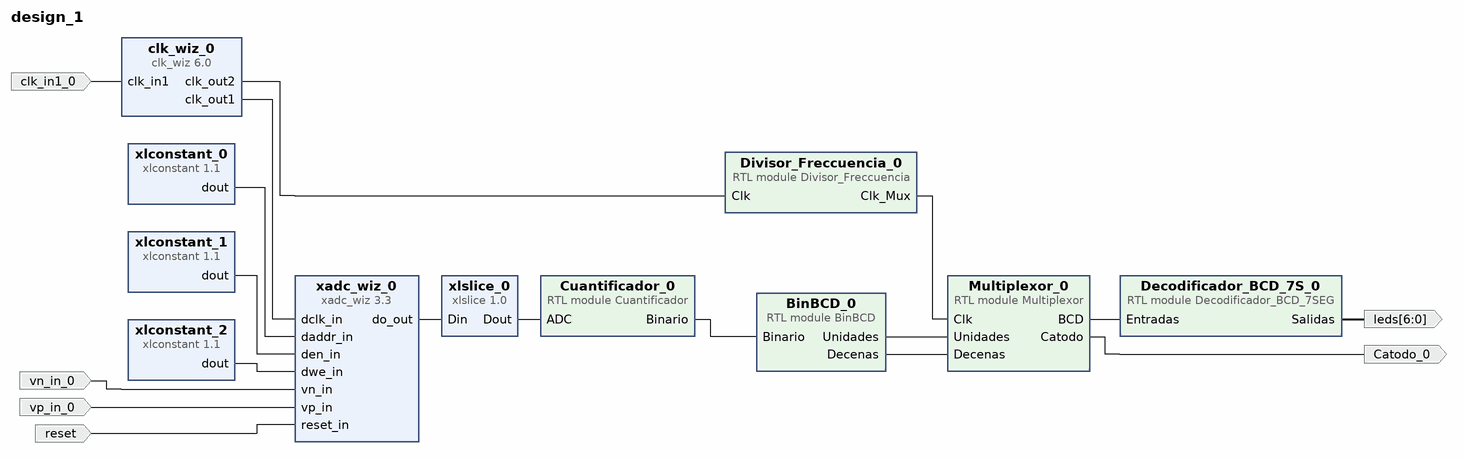
[diagram p0: block diagram of the top level]
# Vivado block design design_1, xc7z007sclg400-1, Vivado 2019.1
create_bd_design design_1

create_bd_port -dir I vn_in_0
create_bd_port -dir I vp_in_0
create_bd_port -dir I reset
create_bd_port -dir O -from 6 -to 0 leds
create_bd_port -dir I -type clk clk_in1_0
set_property -dict {CONFIG.FREQ_HZ 125000000} [get_bd_ports clk_in1_0]
create_bd_port -dir O Catodo_0

create_bd_cell -type ip -vlnv xilinx.com:ip:xadc_wiz:3.3 xadc_wiz_0
set_property -dict [list \
  CONFIG.ACQUISITION_TIME 10 \
  CONFIG.ADC_CONVERSION_RATE 39 \
  CONFIG.CHANNEL_AVERAGING 256 \
  CONFIG.DCLK_FREQUENCY 8 \
  CONFIG.ENABLE_RESET true \
  CONFIG.ENABLE_VCCDDRO_ALARM false \
  CONFIG.ENABLE_VCCPAUX_ALARM false \
  CONFIG.ENABLE_VCCPINT_ALARM false \
  CONFIG.EXTERNAL_MUX_CHANNEL VP_VN \
  CONFIG.INTERFACE_SELECTION ENABLE_DRP \
  CONFIG.OT_ALARM false \
  CONFIG.SINGLE_CHANNEL_ACQUISITION_TIME true \
  CONFIG.SINGLE_CHANNEL_SELECTION VP_VN \
  CONFIG.USER_TEMP_ALARM false \
  CONFIG.VCCAUX_ALARM false \
  CONFIG.VCCINT_ALARM false \
] [get_bd_cells xadc_wiz_0]
create_bd_cell -type ip -vlnv xilinx.com:ip:clk_wiz:6.0 clk_wiz_0
set_property -dict [list \
  CONFIG.AXI_DRP false \
  CONFIG.CLKOUT1_JITTER 229.409 \
  CONFIG.CLKOUT1_PHASE_ERROR 248.921 \
  CONFIG.CLKOUT1_REQUESTED_OUT_FREQ 104.000 \
  CONFIG.CLKOUT2_JITTER 231.620 \
  CONFIG.CLKOUT2_PHASE_ERROR 248.921 \
  CONFIG.CLKOUT2_REQUESTED_OUT_FREQ 100.000 \
  CONFIG.CLKOUT2_USED true \
  CONFIG.CLK_IN1_BOARD_INTERFACE sys_clock \
  CONFIG.MMCM_CLKFBOUT_MULT_F 25.375 \
  CONFIG.MMCM_CLKIN2_PERIOD 10.000 \
  CONFIG.MMCM_CLKOUT0_DIVIDE_F 7.625 \
  CONFIG.MMCM_CLKOUT1_DIVIDE 8 \
  CONFIG.MMCM_DIVCLK_DIVIDE 4 \
  CONFIG.NUM_OUT_CLKS 2 \
  CONFIG.PHASE_DUTY_CONFIG false \
  CONFIG.USE_BOARD_FLOW true \
  CONFIG.USE_DYN_RECONFIG false \
  CONFIG.USE_LOCKED false \
  CONFIG.USE_RESET false \
] [get_bd_cells clk_wiz_0]
create_bd_cell -type ip -vlnv xilinx.com:ip:xlconstant:1.1 xlconstant_0
set_property -dict {CONFIG.CONST_VAL 3 CONFIG.CONST_WIDTH 7} [get_bd_cells xlconstant_0]
create_bd_cell -type ip -vlnv xilinx.com:ip:xlconstant:1.1 xlconstant_1
create_bd_cell -type ip -vlnv xilinx.com:ip:xlconstant:1.1 xlconstant_2
set_property -dict {CONFIG.CONST_VAL 0} [get_bd_cells xlconstant_2]
create_bd_cell -type ip -vlnv xilinx.com:ip:xlslice:1.0 xlslice_0
set_property -dict {CONFIG.DIN_FROM 15 CONFIG.DIN_TO 4 CONFIG.DIN_WIDTH 16 CONFIG.DOUT_WIDTH 12} [get_bd_cells xlslice_0]
create_bd_cell -type module -reference Divisor_Freccuencia Divisor_Freccuencia_0
create_bd_cell -type module -reference Decodificador_BCD_7SEG Decodificador_BCD_7S_0
create_bd_cell -type module -reference BinBCD BinBCD_0
create_bd_cell -type module -reference Multiplexor Multiplexor_0
create_bd_cell -type module -reference Cuantificador Cuantificador_0

# ---- connections ----

connect_bd_net [get_bd_pins clk_wiz_0/clk_out1] [get_bd_pins xadc_wiz_0/dclk_in]
connect_bd_net [get_bd_pins xlconstant_0/dout] [get_bd_pins xadc_wiz_0/daddr_in]
connect_bd_net [get_bd_pins xlconstant_1/dout] [get_bd_pins xadc_wiz_0/den_in]
connect_bd_net [get_bd_pins xlconstant_2/dout] [get_bd_pins xadc_wiz_0/dwe_in]
connect_bd_net -net vn_in_0_1 [get_bd_ports vn_in_0] [get_bd_pins xadc_wiz_0/vn_in]
connect_bd_net -net vp_in_0_1 [get_bd_ports vp_in_0] [get_bd_pins xadc_wiz_0/vp_in]
connect_bd_net [get_bd_ports reset] [get_bd_pins xadc_wiz_0/reset_in]
connect_bd_net -net clk_in1_0_1 [get_bd_ports clk_in1_0] [get_bd_pins clk_wiz_0/clk_in1]
connect_bd_net [get_bd_pins clk_wiz_0/clk_out2] [get_bd_pins Divisor_Freccuencia_0/Clk]
connect_bd_net [get_bd_pins Decodificador_BCD_7S_0/Salidas] [get_bd_ports leds]
connect_bd_net [get_bd_pins Multiplexor_0/BCD] [get_bd_pins Decodificador_BCD_7S_0/Entradas]
connect_bd_net [get_bd_pins Divisor_Freccuencia_0/Clk_Mux] [get_bd_pins Multiplexor_0/Clk]
connect_bd_net [get_bd_pins Multiplexor_0/Catodo] [get_bd_ports Catodo_0]
connect_bd_net [get_bd_pins Cuantificador_0/Binario] [get_bd_pins BinBCD_0/Binario]
connect_bd_net [get_bd_pins BinBCD_0/Unidades] [get_bd_pins Multiplexor_0/Unidades]
connect_bd_net [get_bd_pins BinBCD_0/Decenas] [get_bd_pins Multiplexor_0/Decenas]
connect_bd_net [get_bd_pins xlslice_0/Dout] [get_bd_pins Cuantificador_0/ADC]
connect_bd_net [get_bd_pins xadc_wiz_0/do_out] [get_bd_pins xlslice_0/Din]

set_property USER_COMMENTS.comment_0 {Constant 0 tiene una direccion = 3
} [current_bd_design]
set_property USER_COMMENTS.comment_1 {8 bits menos significativos
} [current_bd_design]
set_property USER_COMMENTS.comment_2 {8 bits mas significativos} [current_bd_design]

validate_bd_design
save_bd_design
